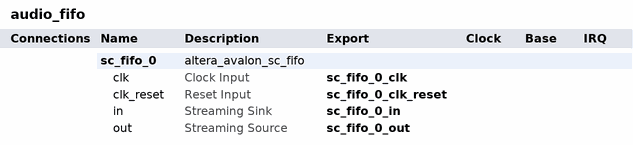
[diagram p0: system contents]
# Platform Designer (Qsys) system audio_fifo, Cyclone V 5CSEMA5F31C6
# Parameters at their usual value, and those the tool derives, are not listed.
package require -exact qsys 22.1
create_system audio_fifo
set_project_property DEVICE_FAMILY {Cyclone V}
set_project_property DEVICE 5CSEMA5F31C6

add_instance sc_fifo_0 altera_avalon_sc_fifo 22.1
set_instance_parameter_value sc_fifo_0 BITS_PER_SYMBOL 16
set_instance_parameter_value sc_fifo_0 CHANNEL_WIDTH 0
set_instance_parameter_value sc_fifo_0 ERROR_WIDTH 0
set_instance_parameter_value sc_fifo_0 FIFO_DEPTH 1024
set_instance_parameter_value sc_fifo_0 USE_FILL_LEVEL 0
set_instance_parameter_value sc_fifo_0 USE_MEMORY_BLOCKS 1
set_instance_parameter_value sc_fifo_0 USE_STORE_FORWARD 0

# exported interfaces
add_interface sc_fifo_0_clk clock sink
set_interface_property sc_fifo_0_clk EXPORT_OF sc_fifo_0.clk
add_interface sc_fifo_0_clk_reset reset sink
set_interface_property sc_fifo_0_clk_reset EXPORT_OF sc_fifo_0.clk_reset
add_interface sc_fifo_0_in avalon_streaming sink
set_interface_property sc_fifo_0_in EXPORT_OF sc_fifo_0.in
add_interface sc_fifo_0_out avalon_streaming source
set_interface_property sc_fifo_0_out EXPORT_OF sc_fifo_0.out

set_interconnect_requirement {$system} qsys_mm.clockCrossingAdapter HANDSHAKE
set_interconnect_requirement {$system} qsys_mm.enableEccProtection FALSE
set_interconnect_requirement {$system} qsys_mm.insertDefaultSlave FALSE
set_interconnect_requirement {$system} qsys_mm.maxAdditionalLatency 1

save_system audio_fifo.qsys
